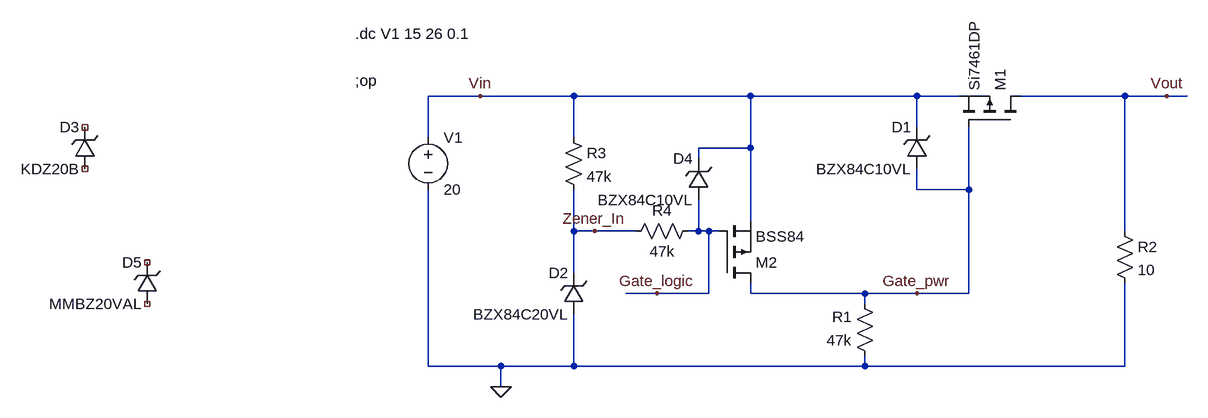
[diagram p0: schematic OvervoltageProtection.asc]
OvervoltageProtection.asc, the LTspice schematic file:
Version 4
SHEET 1 880 680
WIRE -288 80 -368 80
WIRE -144 80 -288 80
WIRE 128 80 -144 80
WIRE 384 80 128 80
WIRE 448 80 384 80
WIRE 704 80 544 80
WIRE 768 80 704 80
WIRE 800 80 768 80
WIRE 384 128 384 80
WIRE -368 144 -368 80
WIRE -144 144 -144 80
WIRE 128 160 128 80
WIRE 128 160 48 160
WIRE 48 176 48 160
WIRE 384 224 384 192
WIRE 464 224 464 128
WIRE 464 224 384 224
WIRE 128 272 128 160
WIRE -144 288 -144 224
WIRE -112 288 -144 288
WIRE -48 288 -112 288
WIRE 48 288 48 240
WIRE 48 288 32 288
WIRE 64 288 48 288
WIRE 80 288 64 288
WIRE 704 288 704 80
WIRE -144 352 -144 288
WIRE -16 384 -64 384
WIRE 64 384 64 288
WIRE 64 384 -16 384
WIRE 128 384 128 368
WIRE 304 384 128 384
WIRE 384 384 304 384
WIRE 464 384 464 224
WIRE 464 384 384 384
WIRE 304 400 304 384
WIRE -368 496 -368 224
WIRE -256 496 -368 496
WIRE -144 496 -144 416
WIRE -144 496 -256 496
WIRE 304 496 304 480
WIRE 304 496 -144 496
WIRE 704 496 704 368
WIRE 704 496 304 496
WIRE -256 528 -256 496
FLAG -256 528 0
FLAG -288 80 Vin
FLAG 768 80 Vout
FLAG 384 384 Gate_pwr
FLAG -16 384 Gate_logic
FLAG -112 288 Zener_In
SYMBOL voltage -368 128 R0
WINDOW 123 0 0 Left 0
WINDOW 39 0 0 Left 0
SYMATTR InstName V1
SYMATTR Value 20
SYMBOL pmos 544 128 M270
SYMATTR InstName M1
SYMATTR Value Si7461DP
SYMBOL zener 400 192 R180
WINDOW 0 24 64 Left 2
WINDOW 3 24 0 Left 2
SYMATTR InstName D1
SYMATTR Value BZX84C10VL
SYMBOL zener -128 416 R180
WINDOW 0 24 64 Left 2
WINDOW 3 24 0 Left 2
SYMATTR InstName D2
SYMATTR Value BZX84C20VL
SYMBOL res -160 128 R0
SYMATTR InstName R3
SYMATTR Value 47k
SYMBOL res 48 272 R90
WINDOW 0 0 56 VBottom 2
WINDOW 3 32 56 VTop 2
SYMATTR InstName R4
SYMATTR Value 47k
SYMBOL res 320 496 R180
WINDOW 0 36 76 Left 2
WINDOW 3 36 40 Left 2
SYMATTR InstName R1
SYMATTR Value 47k
SYMBOL pmos 80 368 M180
SYMATTR InstName M2
SYMATTR Value BSS84
SYMBOL res 688 272 R0
SYMATTR InstName R2
SYMATTR Value 10
SYMBOL zener -880 192 R180
WINDOW 0 24 64 Left 2
WINDOW 3 24 0 Left 2
SYMATTR InstName D3
SYMATTR Value KDZ20B
SYMBOL zener -784 400 R180
WINDOW 0 24 64 Left 2
WINDOW 3 24 0 Left 2
SYMATTR InstName D5
SYMATTR Value MMBZ20VAL
SYMBOL zener 64 240 R180
WINDOW 0 24 64 Left 2
WINDOW 3 24 0 Left 2
SYMATTR InstName D4
SYMATTR Value BZX84C10VL
TEXT -480 56 Left 2 !;op
TEXT -480 -16 Left 2 !.dc V1 15 26 0.1

The netlist it stands for:
* OvervoltageProtection.asc
V1 Vin 0 20
M1 Vout Gate_pwr Vin Vin Si7461DP
D1 Gate_pwr Vin BZX84C10VL
D2 0 Zener_In BZX84C20VL
R3 Vin Zener_In 47k
R4 Gate_logic Zener_In 47k
R1 0 Gate_pwr 47k
M2 Gate_pwr Gate_logic Vin Vin BSS84
R2 Vout 0 10
D3 NC_01 NC_02 KDZ20B
D5 NC_03 NC_04 MMBZ20VAL
D4 Gate_logic Vin BZX84C10VL
.model D D
.lib standard.dio
.model NMOS NMOS
.model PMOS PMOS
.lib standard.mos
;op
.dc V1 15 26 0.1
.backanno
.end